# EAGLE design base (1) (EAGLE 9.3.1)
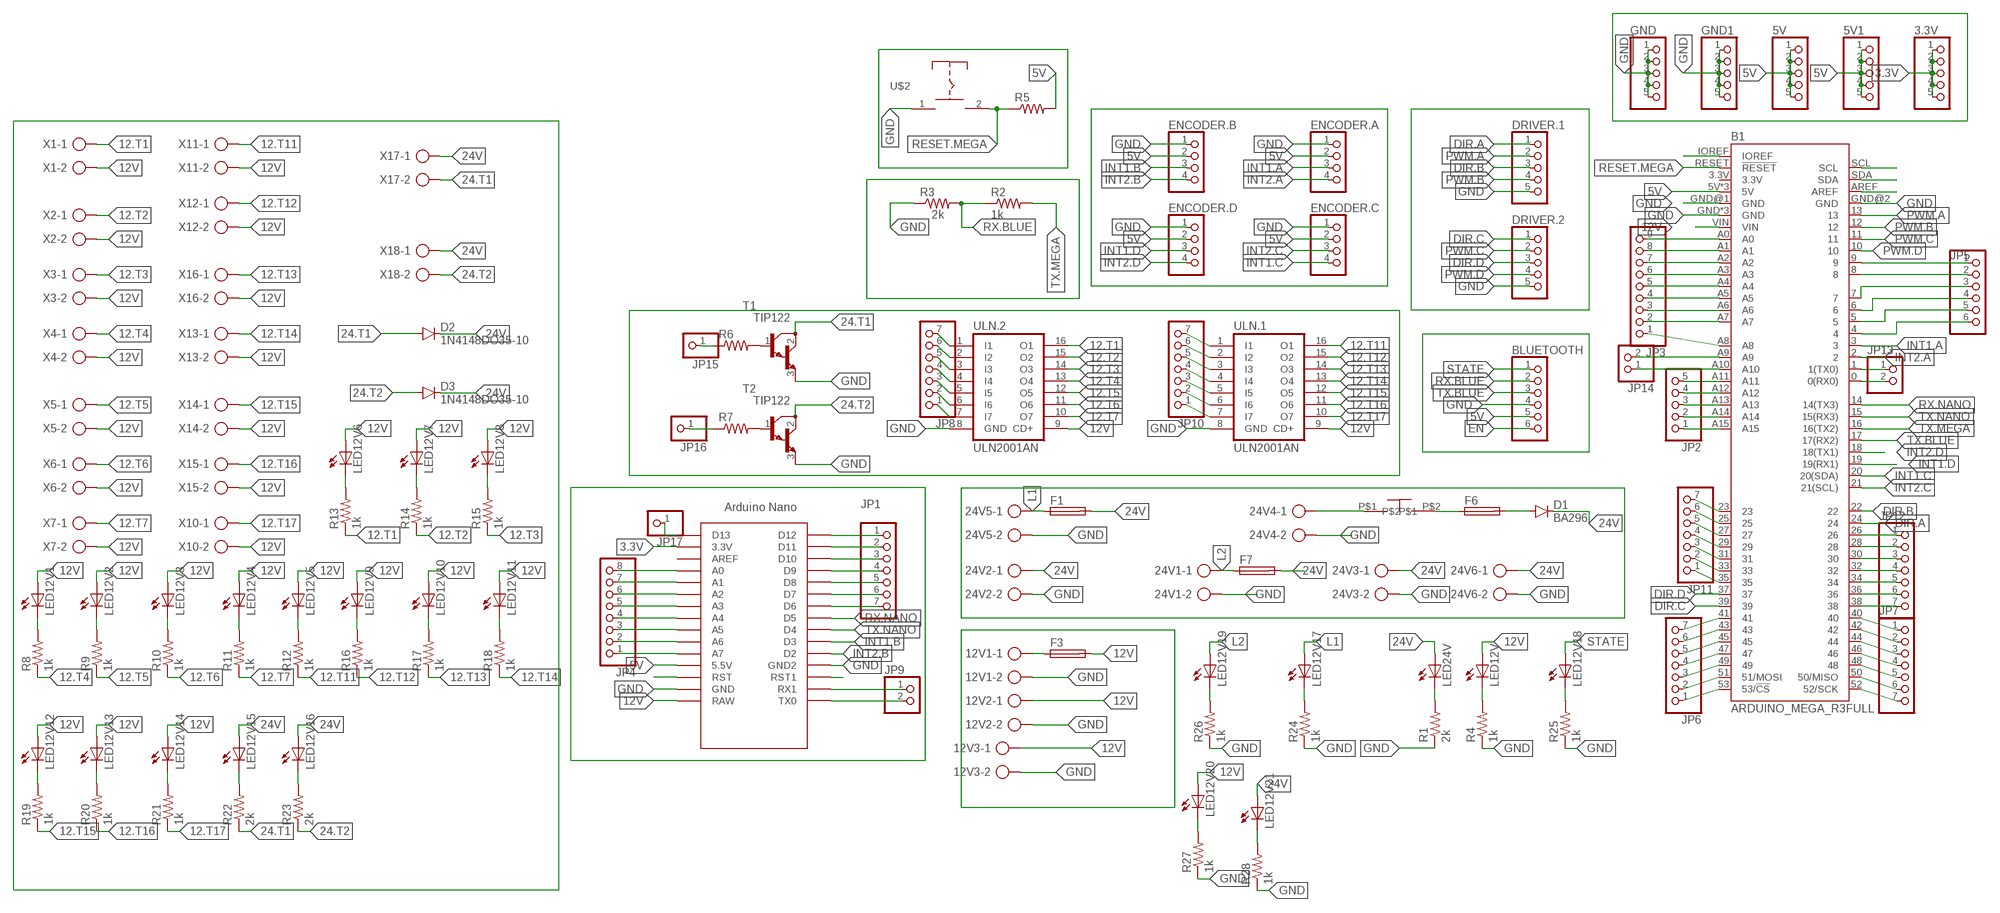
[diagram p0: schematic, sheet 1]

## Parts
3.3V  PINHD-1X5  [1X05]
5V  PINHD-1X5  [1X05]
5V1  PINHD-1X5  [1X05]
12V1  AK300/2  [AK300/2]
12V2  AK300/2  [AK300/2]
12V3  AK300/2  [AK300/2]
24V1  W237-113  [W237-113]
24V2  AK300/2  [AK300/2]
24V3  AK300/2  [AK300/2]
24V4  W237-113  [W237-113]
24V5  W237-113  [W237-113]
24V6  AK300/2  [AK300/2]
B1  ARDUINO_MEGA_R3FULL  [ARDUINO_MEGA_NO_SILK]
BLUETOOTH  PINHD-1X6  [1X06]
D1  BA296  [P2-15]
D2  1N4148DO35-10  [DO35-10]
D3  1N4148DO35-10  [DO35-10]
DRIVER.1  PINHD-1X5  [1X05]
DRIVER.2  PINHD-1X5  [1X05]
ENCODER.A  PINHD-1X4  [1X04]
ENCODER.B  PINHD-1X4  [1X04]
ENCODER.C  PINHD-1X4  [1X04]
ENCODER.D  PINHD-1X4  [1X04]
F1  SH22,5A  [SH22,5A]
F3  SH22,5A  [SH22,5A]
F6  SH22,5A  [SH22,5A]
F7  SH22,5A  [SH22,5A]
GND  PINHD-1X5  [1X05]
GND1  PINHD-1X5  [1X05]
JP1  PINHD-1X7  [1X07]
JP2  PINHD-1X5  [1X05]
JP3  PINHD-1X9  [1X09]
JP4  PINHD-1X8  [1X08]
JP5  PINHD-1X6  [1X06]
JP6  PINHD-1X7  [1X07]
JP7  PINHD-1X7  [1X07]
JP8  PINHD-1X7  [1X07]
JP9  PINHD-1X2  [1X02]
JP10  PINHD-1X7  [1X07]
JP11  PINHD-1X7  [1X07]
JP12  PINHD-1X7  [1X07]
JP13  PINHD-1X2  [1X02]
JP14  PINHD-1X2  [1X02]
JP15  PINHD-1X1  [1X01]
JP16  PINHD-1X1  [1X01]
JP17  PINHD-1X1  [1X01]
LED12V  LED5MM  [LED5MM]
LED12V1  LED3MM  [LED3MM]
LED12V2  LED3MM  [LED3MM]
LED12V3  LED3MM  [LED3MM]
LED12V4  LED3MM  [LED3MM]
LED12V5  LED3MM  [LED3MM]
LED12V6  LED3MM  [LED3MM]
LED12V7  LED3MM  [LED3MM]
LED12V8  LED3MM  [LED3MM]
LED12V9  LED3MM  [LED3MM]
LED12V10  LED3MM  [LED3MM]
LED12V11  LED3MM  [LED3MM]
LED12V12  LED3MM  [LED3MM]
LED12V13  LED3MM  [LED3MM]
LED12V14  LED3MM  [LED3MM]
LED12V15  LED3MM  [LED3MM]
LED12V16  LED3MM  [LED3MM]
LED12V17  LED3MM  [LED3MM]
LED12V18  LED3MM  [LED3MM]
LED12V19  LED3MM  [LED3MM]
LED12V20  LED3MM  [LED3MM]
LED12V21  LED3MM  [LED3MM]
LED24V  LED5MM  [LED5MM]
R1  2k  R-US_0207/10  [0207/10]
R2  1k  R-US_0204/7  [0204/7]
R3  2k  R-US_0207/10  [0207/10]
R4  1k  R-US_0207/10  [0207/10]
R5  R-US_0204/7  [0204/7]
R6  R-US_0207/10  [0207/10]
R7  R-US_0207/10  [0207/10]
R8  1k  R-US_0207/10  [0207/10]
R9  1k  R-US_0207/10  [0207/10]
R10  1k  R-US_0207/10  [0207/10]
R11  1k  R-US_0207/10  [0207/10]
R12  1k  R-US_0207/10  [0207/10]
R13  1k  R-US_0207/10  [0207/10]
R14  1k  R-US_0207/10  [0207/10]
R15  1k  R-US_0207/10  [0207/10]
R16  1k  R-US_0207/10  [0207/10]
R17  1k  R-US_0207/10  [0207/10]
R18  1k  R-US_0207/10  [0207/10]
R19  1k  R-US_0207/10  [0207/10]
R20  1k  R-US_0207/10  [0207/10]
R21  1k  R-US_0207/10  [0207/10]
R22  2k  R-US_0207/10  [0207/10]
R23  2k  R-US_0207/10  [0207/10]
R24  1k  R-US_0207/12  [0207/12]
R25  1k  R-US_0204/5  [0204/5]
R26  1k  R-US_0204/5  [0204/5]
R27  1k  R-US_0204/5  [0204/5]
R28  1k  R-US_0204/5  [0204/5]
T1  TIP122  [TO220]
T2  TIP122  [TO220]
U$1  NANO  [NANO]
U$2  PUSHBOTTON  [PUSHBOTTON]
U$3  ON_OFF  [ON_OFF]
ULN.1  ULN2001AN  [DIL16]
ULN.2  ULN2001AN  [DIL16]
X1  AK300/2  [AK300/2]
X2  AK300/2  [AK300/2]
X3  AK300/2  [AK300/2]
X4  AK300/2  [AK300/2]
X5  AK300/2  [AK300/2]
X6  AK300/2  [AK300/2]
X7  AK300/2  [AK300/2]
X10  AK300/2  [AK300/2]
X11  AK300/2  [AK300/2]
X12  AK300/2  [AK300/2]
X13  AK300/2  [AK300/2]
X14  AK300/2  [AK300/2]
X15  AK300/2  [AK300/2]
X16  AK300/2  [AK300/2]
X17  AK300/2  [AK300/2]
X18  AK300/2  [AK300/2]

## Nets
3.3V: 3.3V.1 3.3V.2 3.3V.3 3.3V.4 3.3V.5 U$1.3.3V
5V: 5V1.1 5V1.2 5V1.3 5V1.4 5V1.5 5V.1 5V.2 5V.3 5V.4 5V.5 B1.5V B1.5V@1(5V) B1.5V@2(5V) BLUETOOTH.5 ENCODER.A.2 ENCODER.B.2 ENCODER.C.2 ENCODER.D.2 R5.2 U$1.5V(5.5V)
12.T1: R13.1 ULN.2.16(O1) X1.1
12.T2: R14.1 ULN.2.15(O2) X2.1
12.T3: R15.1 ULN.2.14(O3) X3.1
12.T4: R8.1 ULN.2.13(O4) X4.1
12.T5: R9.1 ULN.2.12(O5) X5.1
12.T6: R10.1 ULN.2.11(O6) X6.1
12.T7: R11.1 ULN.2.10(O7) X7.1
12.T11: R12.1 ULN.1.16(O1) X11.1
12.T12: R16.1 ULN.1.15(O2) X12.1
12.T13: R17.1 ULN.1.14(O3) X16.1
12.T14: R18.1 ULN.1.13(O4) X13.1
12.T15: R19.1 ULN.1.12(O5) X14.1
12.T16: R20.1 ULN.1.11(O6) X15.1
12.T17: R21.1 ULN.1.10(O7) X10.1
12V: 12V2.1 12V3.1 B1.VIN F3.2 LED12V1.A LED12V2.A LED12V3.A LED12V4.A LED12V5.A LED12V6.A LED12V7.A LED12V8.A LED12V9.A LED12V10.A LED12V11.A LED12V12.A LED12V13.A LED12V14.A LED12V20.A LED12V.A U$1.RAW ULN.1.9(CD+) ULN.2.9(CD+) X1.2 X2.2 X3.2 X4.2 X5.2 X6.2 X7.2 X10.2 X11.2 X12.2 X13.2 X14.2 X15.2 X16.2
24.T1: D2.A R22.1 T1.2(C) X17.2
24.T2: D3.A R23.1 T2.2(C) X18.2
24V: 24V2.1 24V3.1 24V6.1 D1.C D2.C D3.C F1.2 F7.2 LED12V15.A LED12V16.A LED12V21.A LED24V.A X17.1 X18.1
40: B1.40 JP7.1
DIR.A: B1.24 DRIVER.1.1
DIR.B: B1.22 DRIVER.1.3
DIR.C: B1.39 DRIVER.2.1
DIR.D: B1.37 DRIVER.2.3
EN: BLUETOOTH.6
GND: 12V1.2 12V2.2 12V3.2 24V1.2 24V2.2 24V3.2 24V4.2 24V5.2 24V6.2 B1.GND B1.GND@1(GND) B1.GND@2(GND) B1.GND@3(GND) B1.GND@4(GND) BLUETOOTH.4 DRIVER.1.5 DRIVER.2.5 ENCODER.A.1 ENCODER.B.1 ENCODER.C.1 ENCODER.D.1 GND1.1 GND1.2 GND1.3 GND1.4 GND1.5 GND.1 GND.2 GND.3 GND.4 GND.5 R1.1 R3.1 R4.1 R24.1 R25.1 R26.1 R27.1 R28.1 T1.3(E) T2.3(E) U$1.GND U$1.GND1(GND2) U$2.1 ULN.1.8(GND) ULN.2.8(GND)
INT1.A: B1.3 ENCODER.A.3
INT1.B: ENCODER.B.3 U$1.D3
INT1.C: B1.20(20(SDA)) ENCODER.C.4
INT1.D: B1.19(19(RX1)) ENCODER.D.3
INT2.A: B1.2 ENCODER.A.4
INT2.B: ENCODER.B.4 U$1.D2
INT2.C: B1.21(21(SCL)) ENCODER.C.3
INT2.D: B1.18(18(TX1)) ENCODER.D.4
L1: 24V5.1 F1.1 LED12V17.A
L2: 24V1.1 F7.1 LED12V19.A
N$1: B1.SCL
N$2: B1.SDA
N$3: B1.AREF
N$7: 24V4.1 U$3.P$1
N$8: F6.1 U$3.P$2
N$9: B1.9 JP5.1
N$10: B1.8 JP5.2
N$11: B1.7 JP5.3
N$12: B1.6 JP5.4
N$13: B1.5 JP5.5
N$14: B1.4 JP5.6
N$15: JP8.1 ULN.2.7(I7)
N$16: LED12V1.K(C) R8.2
N$17: B1.1(1(TX0)) JP13.1
N$18: B1.0(0(RX0)) JP13.2
N$21: LED12V18.K(C) R25.2
N$22: LED12V19.K(C) R26.2
N$23: LED24V.K(C) R1.2
N$24: LED12V.K(C) R4.2
N$25: D1.A F6.2
N$27: LED12V2.K(C) R9.2
N$29: LED12V3.K(C) R10.2
N$30: LED12V4.K(C) R11.2
N$31: LED12V5.K(C) R12.2
N$32: LED12V6.K(C) R13.2
N$33: LED12V7.K(C) R14.2
N$34: LED12V8.K(C) R15.2
N$35: LED12V9.K(C) R16.2
N$36: LED12V10.K(C) R17.2
N$37: B1.42 JP7.2
N$38: B1.44 JP7.3
N$39: B1.46 JP7.4
N$40: B1.48 JP7.5
N$41: B1.50(50/MISO) JP7.6
N$42: B1.52(52/SCK) JP7.7
N$43: B1.IOREF
N$44: LED12V11.K(C) R18.2
N$46: LED12V12.K(C) R19.2
N$47: B1.A15 JP2.1
N$48: B1.A14 JP2.2
N$49: B1.A13 JP2.3
N$50: B1.A0 JP3.9
N$51: B1.A1 JP3.8
N$52: B1.A2 JP3.7
N$53: B1.A3 JP3.6
N$54: B1.A4 JP3.5
N$55: B1.A5 JP3.4
N$56: B1.A6 JP3.3
N$57: B1.A7 JP3.2
N$58: B1.A8 JP3.1
N$59: B1.A12 JP2.4
N$60: B1.A11 JP2.5
N$61: LED12V13.K(C) R20.2
N$62: LED12V14.K(C) R21.2
N$63: LED12V15.K(C) R22.2
N$64: LED12V16.K(C) R23.2
N$65: LED12V17.K(C) R24.2
N$66: JP8.2 ULN.2.6(I6)
N$67: JP8.3 ULN.2.5(I5)
N$68: JP8.4 ULN.2.4(I4)
N$69: JP8.5 ULN.2.3(I3)
N$70: JP8.6 ULN.2.2(I2)
N$71: JP8.7 ULN.2.1(I1)
N$72: JP10.1 ULN.1.7(I7)
N$73: JP10.2 ULN.1.6(I6)
N$74: JP10.3 ULN.1.5(I5)
N$75: B1.41 JP6.7
N$76: B1.45 JP6.5
N$77: B1.43 JP6.6
N$78: B1.47 JP6.4
N$79: B1.49 JP6.3
N$80: B1.51(51/MOSI) JP6.2
N$81: B1.53(53/!CS) JP6.1
N$82: JP10.4 ULN.1.4(I4)
N$88: JP10.5 ULN.1.3(I3)
N$89: JP10.6 ULN.1.2(I2)
N$90: JP10.7 ULN.1.1(I1)
N$91: B1.35 JP11.1
N$92: B1.33 JP11.2
N$93: B1.31 JP11.3
N$94: B1.29 JP11.4
N$95: B1.27 JP11.5
N$96: B1.25 JP11.6
N$97: B1.23 JP11.7
N$98: B1.26 JP12.1
N$99: B1.28 JP12.2
N$100: B1.30 JP12.3
N$101: B1.32 JP12.4
N$102: R6.2 T1.1(B)
N$103: R7.2 T2.1(B)
N$104: B1.34 JP12.5
N$106: B1.36 JP12.6
N$107: JP17.1 U$1.D13
N$108: B1.38 JP12.7
N$109: B1.A9 JP14.2
N$110: JP4.8 U$1.A0
N$111: JP4.7 U$1.A1
N$112: JP4.6 U$1.A2
N$113: JP4.5 U$1.A3
N$114: JP4.4 U$1.A4
N$115: JP4.3 U$1.A5
N$116: JP4.2 U$1.A6
N$117: JP4.1 U$1.A7
N$118: B1.A10 JP14.1
N$119: U$1.RST
N$120: JP15.1 R6.1
N$121: JP16.1 R7.1
N$122: JP1.1 U$1.D12
N$123: JP1.2 U$1.D11
N$124: JP1.3 U$1.D10
N$125: JP1.4 U$1.D9
N$126: JP1.5 U$1.D8
N$127: JP1.6 U$1.D7
N$128: JP1.7 U$1.D6
N$131: LED12V20.K(C) R27.2
N$132: LED12V21.K(C) R28.2
N$134: U$1.RST1
N$135: JP9.1 U$1.RX1
N$136: JP9.2 U$1.TX0
N$152: 12V1.1 F3.1
PWM.A: B1.13 DRIVER.1.2
PWM.B: B1.12 DRIVER.1.4
PWM.C: B1.11 DRIVER.2.2
PWM.D: B1.10 DRIVER.2.4
RESET.MEGA: B1.RESET(!RESET) R5.1 U$2.2
RX.BLUE: BLUETOOTH.2 R2.1 R3.2
RX.NANO: B1.14(14(TX3)) U$1.D5
STATE: BLUETOOTH.1 LED12V18.A
TX.BLUE: B1.17(17(RX2)) BLUETOOTH.3
TX.MEGA: B1.16(16(TX2)) R2.2
TX.NANO: B1.15(15(RX3)) U$1.D4
Unconnected: B1.3.3V U$1.AREF

## Library data of the parts
3.3V 5V 5V1 DRIVER.1 DRIVER.2 GND GND1 JP2 = pinhead:PINHD-1X5: PIN HEADER
12V1-12V3 24V2 24V3 24V6 X1-X7 X10-X18 = con-ptr500:AK300/2: CONNECTOR; OC_FARNELL: unknown; OC_NEWARK: unknown
24V1 24V4 24V5 = con-wago-500:W237-113: WAGO SCREW CLAMP; OC_FARNELL: unknown; OC_NEWARK: unknown
B1 = SparkFun-Boards:ARDUINO_MEGA_R3: Arduino Mega R3 ATmega2560 R3 compatible footprint. SparkFun Products: Arduino Mega 2560 R3 <https://www.sparkfun.com/products/11061>
BLUETOOTH JP5 = pinhead:PINHD-1X6: PIN HEADER
D1 = diode:BA296: DIODE
D2 D3 = diode:1N4148: DIODE high speed (Philips)
ENCODER.A ENCODER.B ENCODER.C ENCODER.D = pinhead:PINHD-1X4: PIN HEADER
F1 F3 F6 F7 = fuse:SH22,5A: FUSE HOLDER grid 22,5mm, isolated cap OGN0031 8201, Schurter (Buerklin); MPN: 0031.7701.11; OC_FARNELL: unknown; OC_NEWARK: 04F1224
JP1 JP6-JP8 JP10-JP12 = pinhead:PINHD-1X7: PIN HEADER
JP3 = pinhead:PINHD-1X9: PIN HEADER
JP4 = pinhead:PINHD-1X8: PIN HEADER
JP9 JP13 JP14 = pinhead:PINHD-1X2: PIN HEADER
JP15-JP17 = pinhead:PINHD-1X1: PIN HEADER
LED12V LED12V1-LED12V21 LED24V = led:LED: LED OSRAM: - CHIPLED LG R971, LG N971, LY N971, LG Q971, LY Q971, LO R971, LY R971 LH N974, LH R974 LS Q976, LO Q976, LY Q976 LO Q996 - Hyper CHIPLED LW Q18S LB Q993, LB Q99A, LB R99A - SideLED LS A670, LO A670, LY A670, LG A670, LP A670 LB A673, LV A673, LT A673, LW A673 LH A674 LY A675 LS A676, LA A676, LO A676, LY A676, LW A676 LS A679, LY A679, LG A679 - Hyper Micro SIDELED® LS Y876, LA Y876, LO Y876, LY Y876 LT Y87S - SmartLED LW L88C, LW L88S LB L89C, LB L89S, LG L890 LS L89K, LO L89K, LY L89K LS L896, LA L896, LO L896, LY L896 - TOPLED LS T670, LO T670, LY T670, LG T670, LP T670 LSG T670, LSP T670, LSY T670, LOP T670, LYG T670 LG T671, LOG T671, LSG T671 LB T673, LV T673, LT T673, LW T673 LH T674 LS T676, LA T676, LO T676, LY T676, LB T676, LH T676, LSB T676, LW T676 LB T67C, LV T67C, LT T67C, LS T67K, LO T67K, LY T67K, LW E67C LS E67B, LA E67B, LO E67B, LY E67B, LB E67C, LV E67C, LT E67C LW T67C LS T679, LY T679, LG T679 LS T770, LO T770, LY T770, LG T770, LP T770 LB T773, LV T773, LT T773, LW T773 LH T774 LS E675, LA E675, LY E675, LS T675 LS T776, LA T776, LO T776, LY T776, LB T776 LHGB T686 LT T68C, LB T68C - Hyper Mini TOPLED® LB M676 - Mini TOPLED Santana® LG M470 LS M47K, LO M47K, LY M47K Source: http://www.osram.convergy.de LUXEON: - LUMILED® LXK2-PW12-R00, LXK2-PW12-S00, LXK2-PW14-U00, LXK2-PW14-V00 LXK2-PM12-R00, LXK2-PM12-S00, LXK2-PM14-U00 LXK2-PE12-Q00, LXK2-PE12-R00, LXK2-PE12-S00, LXK2-PE14-T00, LXK2-PE14-U00 LXK2-PB12-K00, LXK2-PB12-L00, LXK2-PB12-M00, LXK2-PB14-N00, LXK2-PB14-P00, LXK2-PB14-Q00 LXK2-PR12-L00, LXK2-PR12-M00, LXK2-PR14-Q00, LXK2-PR14-R00 LXK2-PD12-Q00, LXK2-PD12-R00, LXK2-PD12-S00 LXK2-PH12-R00, LXK2-PH12-S00 LXK2-PL12-P00, LXK2-PL12-Q00, LXK2-PL12-R00 Source: www.luxeon.com KINGBRIGHT: KA-3528ASYC Source: www.kingbright.com
R1-R28 = rcl:R-US_: RESISTOR, American symbol; SPICEPREFIX: R
T1 T2 = transistor:TIP122: NPN BIPOLAR DARLINGTON TRANSISTOR
U$1 = Arduino-clone:NANO: Arduino Nano
U$2 = push botton:PUSHBOTTON
U$3 = ON_OFF:ON_OFF
ULN.1 ULN.2 = uln-udn:ULN2001A: DRIVER ARRAY

## Board
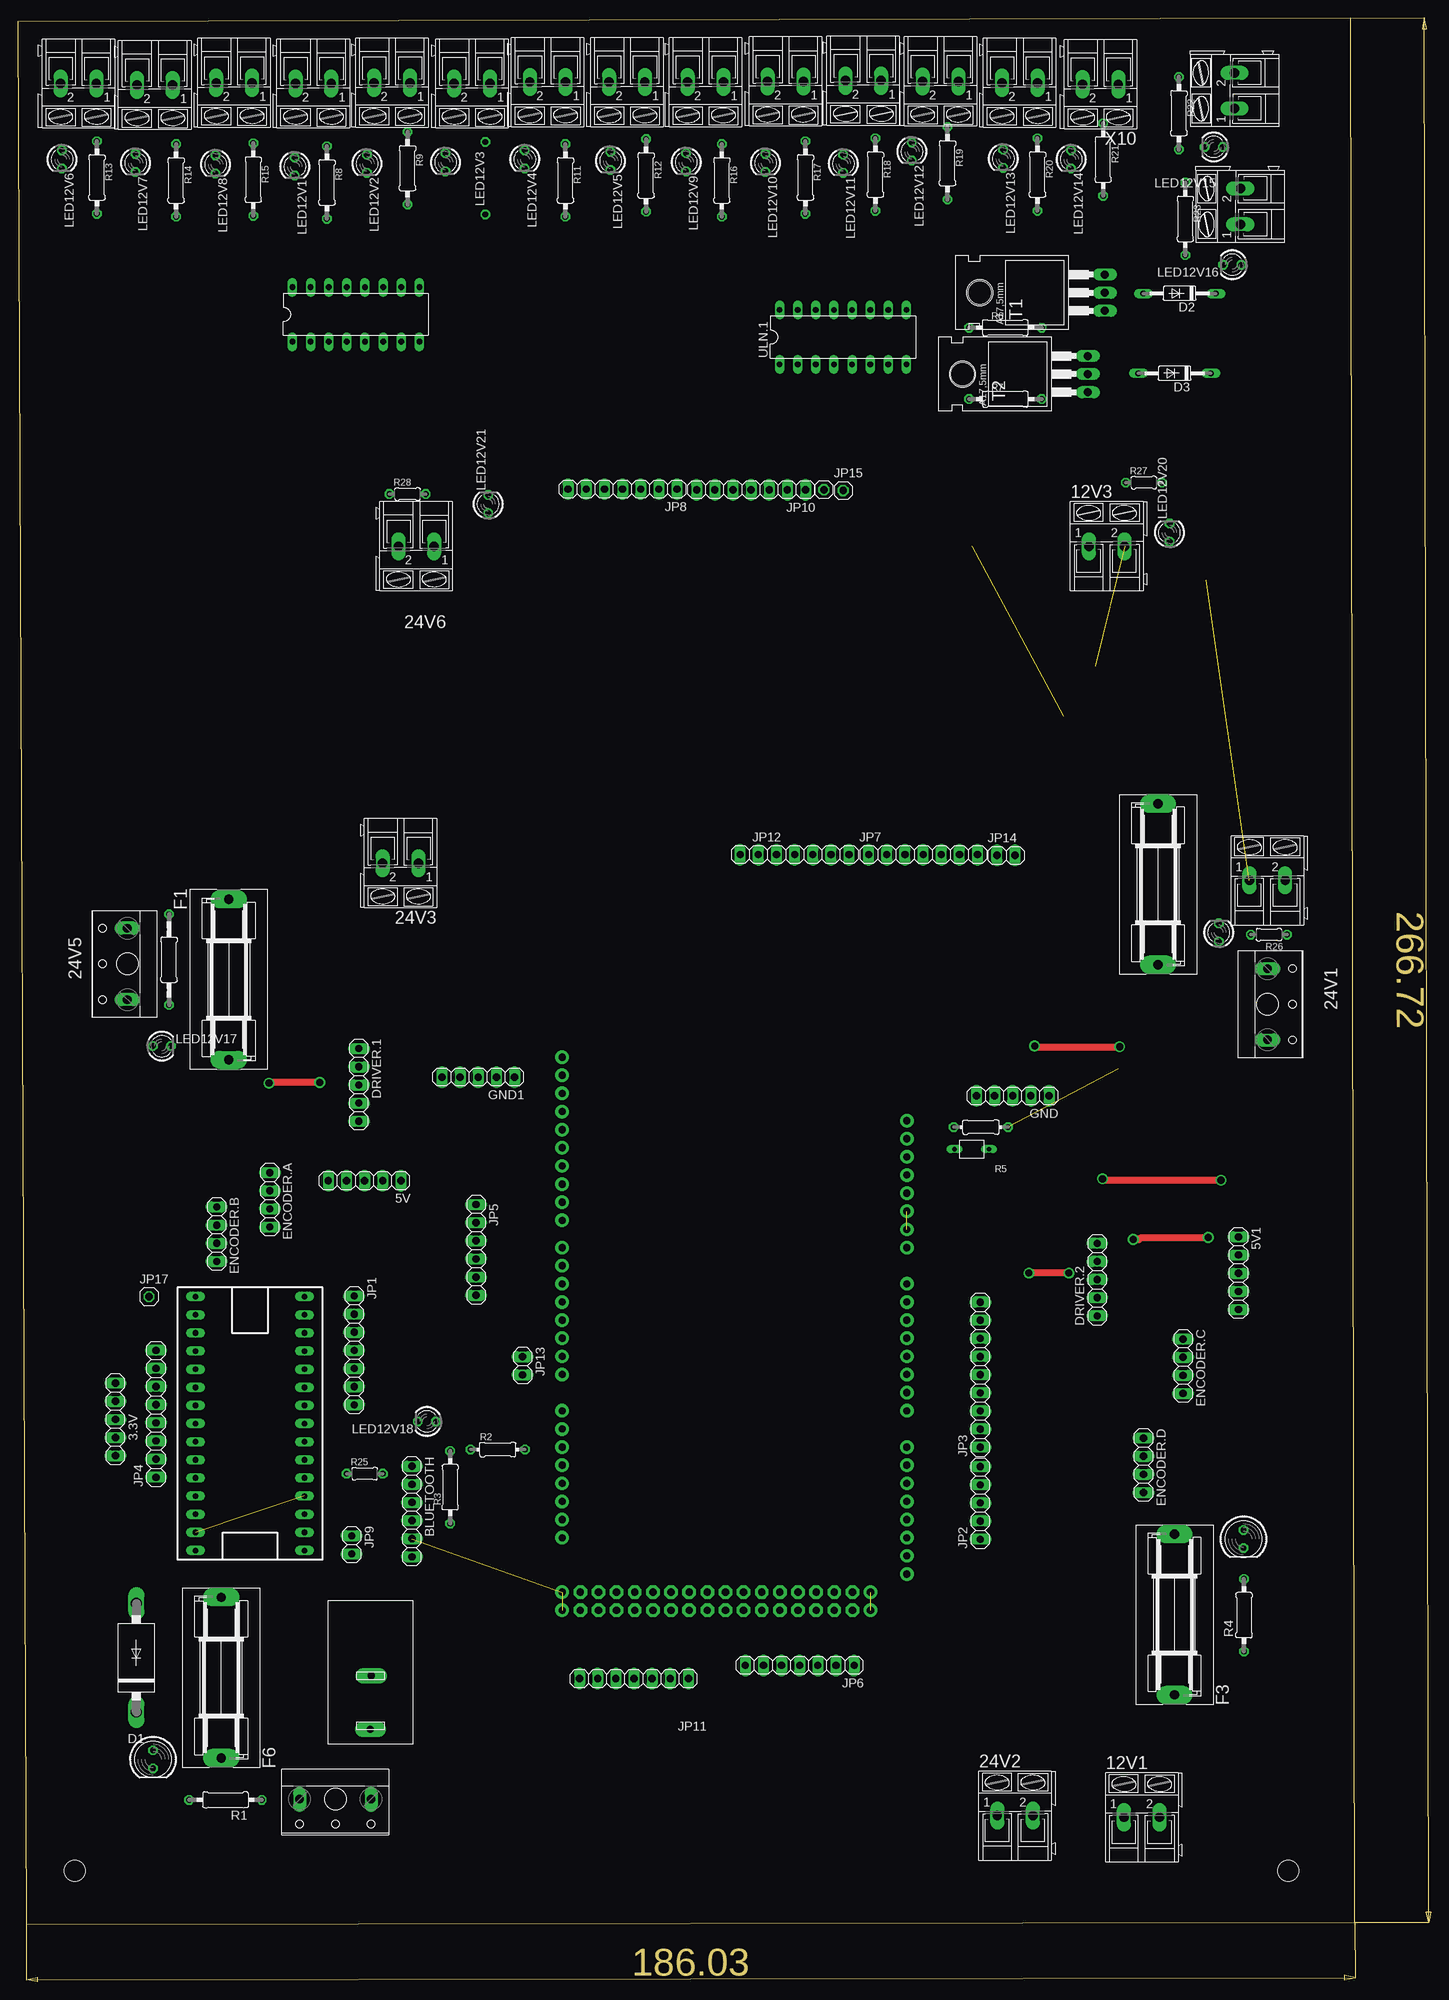
[diagram p1: board, top side]
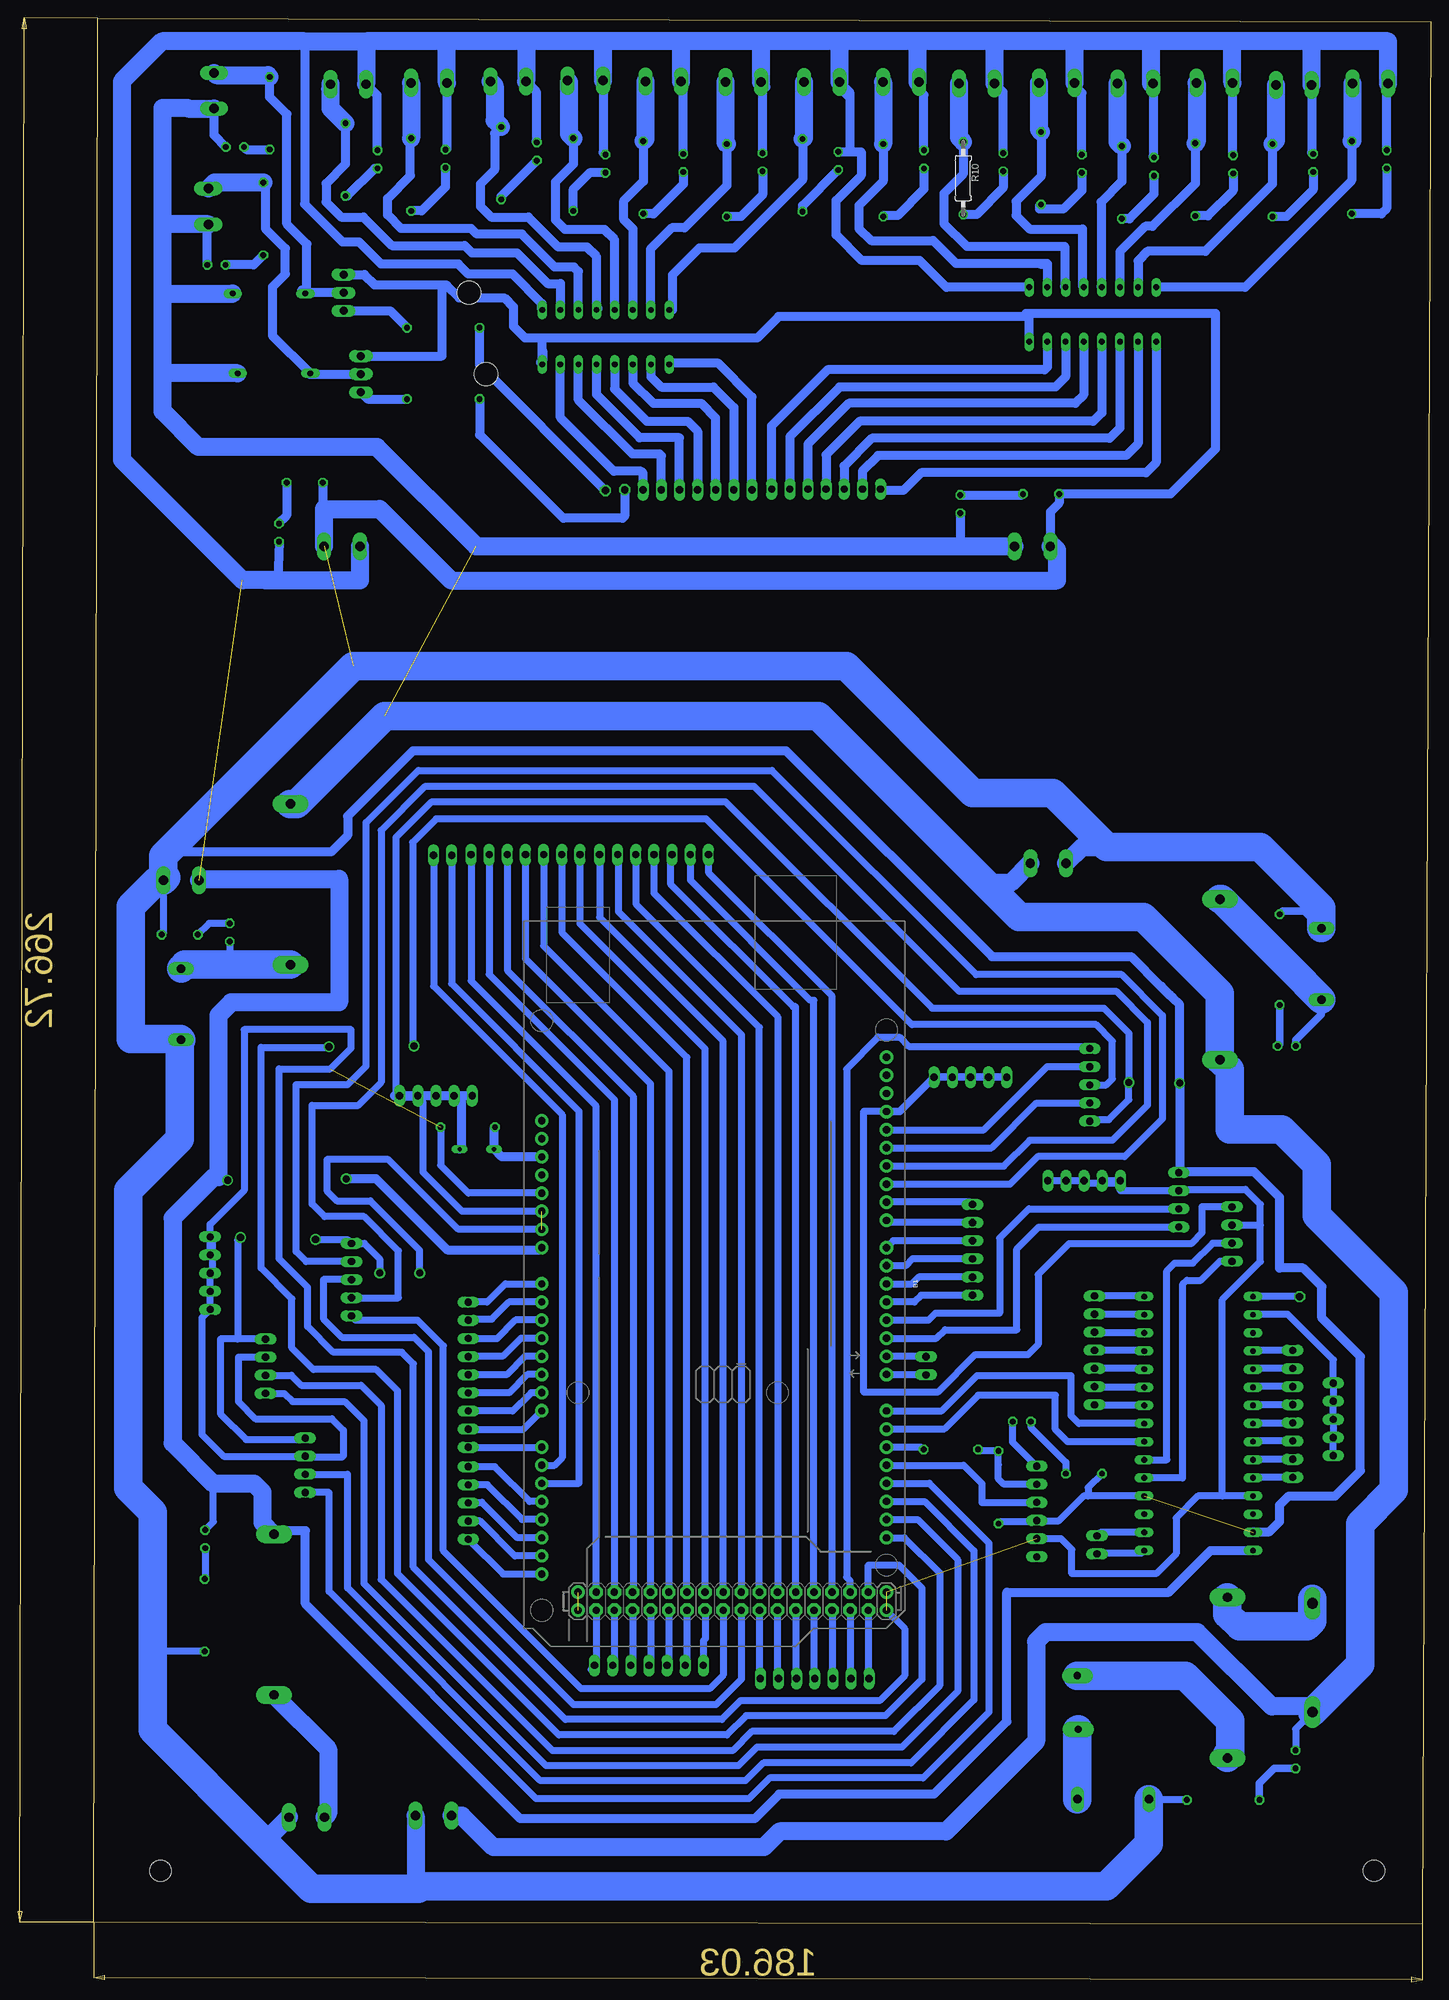
[diagram p2: board, bottom side, seen from below]

Size 187.22 x 267 mm. Coordinates in mm from the lower left corner, seen from the top.
Outline: 1.19,0 187.22,0.28 186.63,267 0,266.49 1.19,0
Copper layers (1*16): Top 0.035mm / dielectric 1.5mm / Bottom 0.035mm
Design rules "default *": minimum track width 6mil, minimum drill 0.35mm, track to track 40mil, track to pad 40mil, pad to pad 6mil, via to via 6mil, smd to smd 6mil, copper to edge 40mil, drill to drill 6mil, minimum pad ring 10mil, minimum via ring 8mil, stop-mask expansion 4mil, vias tented up to drill 0mil, thermal gap 10mil
Holes 3 mm at 7.96,7.52 177.87,7.52

### Footprints (pad centres in the part's own frame; a part is rotated, then mirrored left to right if it is on the bottom)
1X05 = drill 1.016 long: 1 -5.08,0; 2 -2.54,0; 3 0,0; 4 2.54,0; 5 5.08,0
AK300/2 = drill 1.321 long: 1 -2.515,0; 2 2.489,0
W237-113 = drill 1.194 long: 1 -5,-1.27; 2 5,-1.27
ARDUINO_MEGA_NO_SILK = drill 1.016 pad 1.88: 0 13.97,24.13; 1 11.43,24.13; 2 8.89,24.13; 3 6.35,24.13; 3.3V -13.97,-24.13; 4 3.81,24.13; 5 1.27,24.13; 5V -11.43,-24.13; 5V@1 44.45,24.13; 5V@2 46.99,24.13; 6 -1.27,24.13; 7 -3.81,24.13; 8 -7.62,24.13; 9 -10.16,24.13; 10 -12.7,24.13; 11 -15.24,24.13; 12 -17.78,24.13; 13 -20.32,24.13; 14 19.05,24.13; 15 21.59,24.13; 16 24.13,24.13; 17 26.67,24.13; 18 29.21,24.13; 19 31.75,24.13; 20 34.29,24.13; 21 36.83,24.13; A0 1.27,-24.13; A1 3.81,-24.13; A2 6.35,-24.13; A3 8.89,-24.13; A4 11.43,-24.13; A5 13.97,-24.13; A6 16.51,-24.13; A7 19.05,-24.13; A8 24.13,-24.13; A9 26.67,-24.13; A10 29.21,-24.13; A11 31.75,-24.13; A12 34.29,-24.13; A13 36.83,-24.13; A14 39.37,-24.13; A15 41.91,-24.13; AREF -25.4,24.13; GND -8.89,-24.13; GND@1 -6.35,-24.13; GND@2 44.45,-19.05; GND@3 46.99,-19.05; GND@4 -22.86,24.13; IOREF -19.05,-24.13; NC -21.59,-24.13; RESET -16.51,-24.13; SCL -30.48,24.13; SDA -27.94,24.13; VIN -3.81,-24.13 | drill 1.016 pad 1.88 octagon: 22 44.45,21.59; 23 46.99,21.59; 24 44.45,19.05; 25 46.99,19.05; 26 44.45,16.51; 27 46.99,16.51; 28 44.45,13.97; 29 46.99,13.97; 30 44.45,11.43; 31 46.99,11.43; 32 44.45,8.89; 33 46.99,8.89; 34 44.45,6.35; 35 46.99,6.35; 36 44.45,3.81; 37 46.99,3.81; 38 44.45,1.27; 39 46.99,1.27; 40 44.45,-1.27; 41 46.99,-1.27; 42 44.45,-3.81; 43 46.99,-3.81; 44 44.45,-6.35; 45 46.99,-6.35; 46 44.45,-8.89; 47 46.99,-8.89; 48 44.45,-11.43; 49 46.99,-11.43; 50 44.45,-13.97; 51 46.99,-13.97; 52 44.45,-16.51; 53 46.99,-16.51
1X06 = drill 1.016 long: 1 -6.35,0; 2 -3.81,0; 3 -1.27,0; 4 1.27,0; 5 3.81,0; 6 6.35,0
P2-15 = drill 1.499 long: A 7.62,0; C -7.62,0
DO35-10 = drill 0.813 long: A 5.08,0; C -5.08,0
1X04 = drill 1.016 long: 1 -3.81,0; 2 -1.27,0; 3 1.27,0; 4 3.81,0
SH22,5A = drill 1.321 pad 2.54 long: 1 -11.252,0; 2 11.252,0
1X07 = drill 1.016 long: 1 -7.62,0; 2 -5.08,0; 3 -2.54,0; 4 0,0; 5 2.54,0; 6 5.08,0; 7 7.62,0
1X09 = drill 1.016 long: 1 -10.16,0; 2 -7.62,0; 3 -5.08,0; 4 -2.54,0; 5 0,0; 6 2.54,0; 7 5.08,0; 8 7.62,0; 9 10.16,0
1X08 = drill 1.016 long: 1 -8.89,0; 2 -6.35,0; 3 -3.81,0; 4 -1.27,0; 5 1.27,0; 6 3.81,0; 7 6.35,0; 8 8.89,0
1X02 = drill 1.016 long: 1 -1.27,0; 2 1.27,0
1X01 = drill 1.016 octagon: 1 0,0
LED5MM = drill 0.813 octagon: A -1.27,0; K 1.27,0
LED3MM = drill 0.813 octagon: A -1.27,0; K 1.27,0
0207/10 = drill 0.813 octagon: 1 -5.08,0; 2 5.08,0
0204/7 = drill 0.813 octagon: 1 -3.81,0; 2 3.81,0
0207/12 = drill 0.813 octagon: 1 -6.35,0; 2 6.35,0
0204/5 = drill 0.813 octagon: 1 -2.54,0; 2 2.54,0
TO220 = drill 1.118 long: 1 -2.54,-6.35; 2 0,-6.35; 3 2.54,-6.35 | hole 3.302: 0,11.176
NANO = drill 0.8 long: 3.3V -10.16,24.13; 5V -10.16,-1.27; A0 -10.16,19.05; A1 -10.16,16.51; A2 -10.16,13.97; A3 -10.16,11.43; A4 -10.16,8.89; A5 -10.16,6.35; A6 -10.16,3.81; A7 -10.16,1.27; AREF -10.16,21.59; D2 5.08,1.27; D3 5.08,3.81; D4 5.08,6.35; D5 5.08,8.89; D6 5.08,11.43; D7 5.08,13.97; D8 5.08,16.51; D9 5.08,19.05; D10 5.08,21.59; D11 5.08,24.13; D12 5.08,26.67; D13 -10.16,26.67; GND -10.16,-6.35; GND1 5.08,-1.27; RAW -10.16,-8.89; RST -10.16,-3.81; RST1 5.08,-3.81; RX1 5.08,-6.35; TX0 5.08,-8.89
PUSHBOTTON = drill 0.6 long: 1 -12.43,5.08; 2 -7.62,5.08
ON_OFF = drill 1 pad 2.184 long: P$1 2,9; P$2 9.525,8.89
DIL16 = drill 0.813 long: 1 -8.89,-3.81; 2 -6.35,-3.81; 3 -3.81,-3.81; 4 -1.27,-3.81; 5 1.27,-3.81; 6 3.81,-3.81; 7 6.35,-3.81; 8 8.89,-3.81; 9 8.89,3.81; 10 6.35,3.81; 11 3.81,3.81; 12 1.27,3.81; 13 -1.27,3.81; 14 -3.81,3.81; 15 -6.35,3.81; 16 -8.89,3.81

### Placement (x,y rotation side)
3.3V  13.66,70.73 270 top
5V  48.55,104.16 180 top
5V1  170.9,91.2 270 top
12V1  157.39,15 0 top
12V2  174.97,146.22 0 top
12V3  152.47,193.02 0 top
24V1  176.26,128.87 270 top
24V2  139.65,15.22 0 top
24V3  53.56,148.62 180 top
24V4  44.47,16.26 180 top
24V5  14.05,134.52 90 top
24V6  55.77,193.02 180 top
B1  100.34,90.98 270 bottom
BLUETOOTH  55.17,57.83 270 top
D1  16.58,37.34 90 top
D2  162.66,228.42 180 top
D3  161.97,217.22 180 top
DRIVER.1  47.75,117.58 270 top
DRIVER.2  151.13,90.3 90 top
ENCODER.A  35.28,101.48 270 top
ENCODER.B  27.83,96.67 270 top
ENCODER.C  163.16,78.17 270 top
ENCODER.D  157.61,64.3 270 top
F1  29.53,132.34 270 top
F3  161.97,43.4 90 top
F6  28.48,34.55 90 top
F7  159.67,145.68 90 top
GND  139.3,116.04 180 top
GND1  64.46,118.66 180 top
JP1  47.09,80.39 270 top
JP2  134.77,59.02 90 top
JP3  134.77,76.99 90 top
JP4  19.34,71.51 90 top
JP5  64.17,94.47 270 top
JP6  109.48,36.27 180 top
JP7  126.75,149.82 0 top
JP8  84.67,201.02 180 top
JP9  46.74,53.16 270 top
JP10  102.67,200.92 180 top
JP11  86.27,34.42 180 top
JP12  108.77,149.82 0 top
JP13  70.67,78.24 270 top
JP14  138.37,149.72 0 top
JP15  115.56,200.82 0 top
JP16  112.87,200.92 0 top
JP17  18.36,87.92 0 top
LED12V  171.61,53.98 270 top
LED12V1  38.77,246.19 270 top
LED12V2  48.86,246.59 270 top
LED12V3  59.87,246.79 270 top
LED12V4  70.97,247.19 270 top
LED12V5  82.97,246.99 270 top
LED12V6  6.16,247.19 270 top
LED12V7  16.46,246.69 270 top
LED12V8  27.67,246.49 270 top
LED12V9  93.56,246.79 270 top
LED12V10  104.67,246.69 270 top
LED12V11  115.56,246.59 270 top
LED12V12  125.16,248.29 270 top
LED12V13  137.97,247.29 270 top
LED12V14  147.47,247.19 270 top
LED12V15  167.44,248.92 180 top
LED12V16  170.03,232.42 180 top
LED12V17  20.16,123.02 0 top
LED12V18  57.27,70.42 180 top
LED12V19  168.16,138.92 90 top
LED12V20  161.27,194.92 90 top
LED12V21  65.87,198.92 90 top
LED24V  18.93,23.11 270 top
R1  29.07,17.44 180 top
R2  67.2,66.51 0 top
R3  60.53,61.22 90 top
R4  171.68,43.31 90 top
R5  134.84,111.66 0 top
R6  138.27,223.62 0 top
R7  138.27,213.62 0 top
R8  43.27,243.96 270 top
R9  54.56,245.96 270 top
R10  65.47,244.56 270 bottom
R11  76.67,244.26 270 top
R12  87.97,244.96 270 top
R13  11.07,244.66 270 top
R14  22.16,244.26 270 top
R15  32.97,244.36 270 top
R16  98.56,244.26 270 top
R17  110.27,244.66 270 top
R18  120.06,245.06 270 top
R19  130.16,246.66 270 top
R20  142.77,245.06 270 top
R21  151.97,247.16 270 top
R22  162.56,253.66 270 top
R23  163.47,238.86 270 top
R24  21.16,135.12 270 top
R25  48.56,63.12 0 top
R26  175.16,138.62 180 top
R27  157.66,201.92 0 top
R28  54.56,200.32 0 top
T1  145.87,228.52 90 top
T2  143.47,217.12 90 top
U$1  35.05,61.25 0 top
U$2  123.54,113.66 180 top
U$3  58.37,25.32 90 top
ULN.1  115.53,222.3 0 top
ULN.2  47.33,225.47 0 top
X1  8.46,257.82 180 top
X2  19.16,257.62 180 top
X3  30.26,257.92 180 top
X4  41.36,257.82 180 top
X5  52.36,257.92 180 top
X6  63.56,257.82 180 top
X7  74.17,258.02 180 top
X10  151.56,257.72 180 top
X11  85.27,258.02 180 top
X12  96.27,258.02 180 top
X13  118.37,258.22 180 top
X14  129.16,258.12 180 top
X15  140.27,257.92 180 top
X16  107.47,258.12 180 top
X17  170.37,256.82 90 top
X18  171.16,240.62 90 top

### Tracks (layer width: path | path; a pad name or v marks a point on that pad's centre or on a via)
3.3V
  Bottom 1: 3.3V.5 3.3V.4 3.3V.3 3.3V.2 3.3V.1 13.66,79.07 20.07,85.48 24.79,85.48 U$1.3.3V
5V  (3 unrouted)
  Bottom 1: 27.65,98.12 ENCODER.B.2 23.86,97.94 | 5V.1 5V.2 5V.3 48.25,103.86 44.25,103.86 44.55,104.16 5V.4 5V.5 43.47,102.75 ENCODER.A.2 35.08,102.95 25.96,102.95 23.86,100.85 23.86,97.94 | U$1.5V 29.17,59.98 | 29.17,59.98 32.61,59.98 35.67,56.92 35.67,51.92 38.47,49.12 50.27,49.12 50.27,52.52 51.77,54.02 BLUETOOTH.5 | 170.6,94.41 170.91,94.1 5V1.2 5V1.1 170.91,98.04 166.16,102.78 166.16,125.32 151.16,125.32 151.16,122.72 154.06,119.82 161.27,119.82 161.27,93.22 157.27,89.22 157.27,83.72 153.66,80.12 144.06,80.12 142.47,78.52 142.47,50.02 121.16,28.72 99.27,28.72 96.67,31.32 77.17,31.32 73.67,34.82 73.67,41.44 B1.5V@2 | 170.6,96.34 170.6,91.5 5V1.3 5V1.4 5V1.5 172.06,84.96 172.06,68.62 169.01,65.57 ENCODER.D.2 157.47,65.42 152.47,65.42 152.27,65.62 152.27,69.22 153.87,70.82 164.56,70.82 166.97,73.22 166.97,79.44 ENCODER.C.2 | B1.5V 134.75,102.41 138.65,106.31 R5.2 | 29.17,59.98 29.17,87.52 23.86,92.82 23.86,97.94
12.T1
  Bottom 1.27: R13.1 11.07,244.22 26,229.28 ULN.2.16
  Bottom 2.54: X1.1 10.98,249.83 R13.1
12.T2
  Bottom 1.27: 22.36,249.14 R14.1 22.16,243.72 31.57,234.32 39.67,234.32 40.98,233 ULN.2.15
  Bottom 2.54: X2.1 21.68,249.83 R14.1
12.T3
  Bottom 1.27: R15.1 32.97,243.82 38.97,237.82 39.97,237.82 43.53,234.26 ULN.2.14
  Bottom 2.54: X3.1 32.78,249.63 R15.1
12.T4
  Bottom 1.27: R8.1 43.27,244.12 46.17,241.22 46.17,229.38 ULN.2.13
  Bottom 2.54: X4.1 43.88,249.66 R8.1
12.T5
  Bottom 1.27: 55.06,257.62 55.36,257.92 | 55.47,258.02 55.36,257.92 | 55.36,257.92 X5.1 | R9.1 54.56,244.82 58.06,241.32 58.06,239.32 56.17,237.42 48.77,237.42 48.77,229.44 ULN.2.12
  Bottom 2.54: X5.1 54.88,251.36 R9.1
12.T6
  Bottom 1.27: 65.56,257.31 X6.1 | R10.1 65.47,245.12 68.17,242.42 68.17,238.22 64.97,235.02 51.27,235.02 51.27,229.4 ULN.2.11
  Bottom 2.54: X6.1 66.08,250.26 R10.1
12.T7
  Bottom 1.27: 53.77,232.62 54.77,232.62 | 54.77,232.62 66.47,232.62 69.67,235.82 78.37,235.82 80.06,237.52 80.06,240.72 76.67,244.12 R11.1 | ULN.2.10 53.69,232.54 54.69,232.54 54.77,232.62
  Bottom 2.54: X7.1 76.68,249.36 R11.1
12.T11
  Bottom 1.27: R12.1 87.97,244.32 97.52,234.77 102.42,234.77 106.17,231.01 106.17,226.11 ULN.1.16
  Bottom 2.54: X11.1 87.78,250.23 R12.1
12.T12
  Bottom 1.27: R16.1 98.56,243.52 104.47,237.62 106.27,237.62 109.28,234.6 109.28,226.21 ULN.1.15
  Bottom 2.54: X12.1 98.78,249.56 R16.1
12.T13
  Bottom 1.27: R17.1 110.27,244.12 112.97,241.42 112.97,238.72 111.73,237.48 ULN.1.14
  Bottom 2.54: X16.1 109.98,250.03 R17.1
12.T14
  Bottom 1.27: R18.1 120.06,246.52 122.56,244.02 122.56,238.72 121.22,237.37 115.72,237.37 114.27,235.92 ULN.1.13 | X13.1 120.68,258.02
  Bottom 2.54: 120.68,258.02 120.68,250.76 R18.1
12.T15
  Bottom 1.27: R19.1 131.06,250.84 131.06,245.72 133.06,243.72 133.06,240.62 131.56,239.12 126.37,239.12 122.16,234.92 118.17,234.92 116.81,233.56 ULN.1.12 116.61,226.31
  Bottom 2.54: X14.1 131.08,257.52 131.08,252.66 R19.1
12.T16
  Bottom 1.27: 142.78,250.16 142.87,250.07 142.87,244.92 146.06,241.72 146.06,239.42 144.16,237.52 134.37,237.52 133.56,236.72 127.27,236.72 122.66,232.12 119.97,232.12 119.34,231.5 ULN.1.11
  Bottom 2.54: X15.1 142.78,250.16 R20.1
12.T17
  Bottom 1.27: 154.75,257.06 X10.1 | R21.1 151.97,246.52 154.66,243.82 154.66,241.22 152.56,239.12 149.47,239.12 145.47,235.12 135.27,235.12 134.27,234.12 127.97,234.12 123.66,229.82 121.87,229.82 121.87,226.13 ULN.1.10
  Bottom 2.54: X10.1 154.08,254.36 R21.1
12V  (via drill 1 pad 0.95)  (1 unrouted)
  Top 1: v168.47,104.22 152.06,104.22 v151.87,104.42
  Bottom 1: LED12V.A 170.47,56.4 170.47,61.72 | X4.2 39.77,258.71 39.77,259.62 39.86,259.72 39.86,260.22 39.77,260.32 39.17,260.32
  Bottom 1.27: B1.VIN 124.78,94.49 137.74,94.49 147.66,104.42 v151.87,104.42 | U$1.RAW 30.82,52.36 36.67,46.52 59.37,46.52 59.37,28.43 69.56,18.23 91.26,18.23 94.66,14.82 127.47,14.82 157.56,44.92 157.56,55.12 162.06,55.12 162.53,54.66 | 162.66,54.52 162.53,54.66 | 162.53,54.66 F3.2 | 16.62,257.57 X2.2 16.68,248.17 LED12V7.A | 50.36,258.02 50.27,257.92 | 50.27,257.92 X5.2 | X6.2 59.87,256.61 LED12V3.A | 93.06,257.31 X12.2 93.56,257.81 LED12V9.A | 115.88,257.53 X13.2 115.88,248.17 LED12V11.A | LED12V20.A 161.42,188.22 | LED12V6.A 6.16,257.63 X1.2 | X3.2 27.78,247.87 LED12V8.A | X4.2 38.88,247.57 LED12V1.A | LED12V2.A 48.86,256.52 50.27,257.92 | LED12V4.A 70.97,256.22 72.27,257.52 72.18,257.52 X7.2 71.87,258.21 71.87,260.62 | 81.37,248.26 81.37,256.61 X11.2 82.97,257.83 82.97,257.42 81.62,256.08 | ULN.2.9 67.83,229.28 71.56,233.02 79.67,233.02 83.27,236.62 83.27,241.42 79.77,244.92 79.77,248.26 81.37,248.26 | LED12V10.A 104.67,257.81 X16.2 | X14.2 125.28,256.72 125.28,249.67 LED12V12.A | X15.2 137.78,248.75 LED12V13.A | X10.2 147.58,256.22 147.58,248.46 LED12V14.A | ULN.1.9 124.47,226.15 124.47,227.02 128.56,231.12 134.77,231.12 136.16,232.52 146.97,232.52 150.06,235.62 152.37,235.62 157.66,240.92 157.66,263.72 | LED12V5.A 81.37,248.26 | 171.27,104.72 170.37,104.72 169.77,104.72 | 169.77,104.62 168.87,104.62 v168.47,104.22
  Bottom 2.54: 12V2.1 172.25,146.42 152.87,146.42 152.87,129.12 167.97,129.12 169.77,127.32 169.77,104.72 169.77,104.62 | F3.2 163.56,56.25 163.56,60.52 164.77,61.72 170.47,61.72 176.16,67.42 176.16,98.92 170.37,104.72 | X1.2 5.98,263.72 16.68,263.72 | 16.68,263.72 27.78,263.72 | 27.78,263.72 39.17,263.72 | 39.17,263.72 49.88,263.72 | 49.88,263.72 61.08,263.72 | 61.08,263.72 71.87,263.72 | 71.87,263.72 82.78,263.72 | 82.78,263.72 93.78,263.72 | 93.78,263.72 104.98,263.72 | 104.98,263.72 115.88,263.72 | 115.88,263.72 126.66,263.72 | 126.66,263.72 137.78,263.72 | 137.78,263.72 149.08,263.72 | 149.08,263.72 X10.2 | X15.2 137.78,263.72 | 126.66,263.72 126.66,258.13 X14.2 | X2.2 16.68,263.72 | X3.2 27.78,263.72 | 39.17,257.82 39.17,260.32 39.17,263.72 | X5.2 49.88,263.72 | X6.2 61.08,263.72 | 71.87,258.02 71.87,260.62 71.87,263.72 | X11.2 82.78,263.72 | X12.2 93.78,263.72 | X16.2 104.98,263.72 | X13.2 115.88,263.72 | 12V3.1 149.95,188.22 161.42,188.22 163.13,188.22 163.16,188.25 | 149.08,263.72 157.66,263.72 177.66,263.72 183.27,258.12 183.27,205.12 166.4,188.25 163.16,188.25 | 161.19,188.25 163.16,188.25
24.T1
  Bottom 1.27: 157.37,228.64 157.37,228.52 T1.2 | 157.37,228.64 157.37,235.32 160.16,238.12 160.16,253.52 162.56,255.92 R22.1 | 157.66,228.52 158.06,228.92 158.06,228.9 D2.A 157.37,228.64
  Bottom 2.54: X17.2 170.06,259.01 162.83,259.01 R22.1
24.T2
  Bottom 1.27: T2.2 157.1,217.12 D3.A 162.19,222.52 162.19,229.3 160.37,231.12 160.37,234.72 163.16,237.52 163.16,243.64 R23.1
  Bottom 2.54: R23.1 170.33,243.94 X18.2
24V  (1 unrouted)
  Bottom 1: D1.C 18.93,27.37 LED24V.A
  Bottom 1.27: LED12V21.A 65.87,193.02 24V6.1 | LED12V15.A 170.37,250.58 X17.1 | LED12V16.A 171.31,238.68 171.27,238.72 171.16,238.62 X18.1
  Bottom 2.54: D1.C 17.38,30.52 22.27,30.52 32.67,40.92 53.97,40.92 55.27,39.62 55.27,25.62 67.87,13.02 91.17,13.02 93.37,10.82 131.27,10.82 135.67,15.22 24V2.1 | 24V6.1 133.66,193.02 147.56,206.92 172.56,206.92 177.56,211.92 177.56,217.22 | X17.1 173.98,254.31 174.09,254.42 177.56,254.42 177.56,237.72 | 177.56,217.22 177.56,228.32 | 177.56,228.32 177.56,237.72 | X18.1 177.05,238.11 177.06,238.12 177.16,238.12 177.56,237.72 | D2.C 167.84,228.32 177.56,228.32 | D3.C 177.56,217.22 | 24V3.1 58.83,145.87 62.42,145.87
  Bottom 4: F7.2 158.77,156.93 146.48,169.22 85.77,169.22 62.42,145.87 57.63,141.09 40.23,141.09 29.53,130.39 F1.2 28.17,119.72 28.17,111.32 20.87,111.32 18.57,109.02 15.96,106.42 15.96,99.32 5.16,88.52 5.16,60.82 9.86,56.12 9.86,36.44 D1.C
40
  Bottom 1: B1.40 101.62,122.62 119.14,140.14 JP7.1
DIR.A
  Bottom 1: B1.24 81.3,48.13 81.8,48.63 81.8,119.79 77.33,124.26 | 77.33,124.26 77.47,124.26 | 77.33,124.26 74.37,124.26 73.06,122.96 47.75,122.96 DRIVER.1.1
DIR.B  (via drill 1 pad 0.95)
  Top 1: v154.27,122.92 154.16,122.82 142.56,122.82 v142.37,123.02
  Bottom 1: B1.22 78.76,50.32 74.47,50.32 71.27,47.12 71.27,34.32 76.37,29.22 95.87,29.22 98.56,26.52 122.06,26.52 144.66,49.12 144.66,74.72 147.66,77.72 156.47,77.72 159.47,80.72 159.47,87.62 163.77,91.92 163.77,122.82 154.37,122.82 v154.27,122.92 | v142.37,123.02 142.56,123.22 142.56,151.52 139.27,154.82 101.47,154.82 72.67,126.02 46.86,126.02 44.56,123.72 44.56,118.42 45.41,117.58 DRIVER.1.3
DIR.C
  Bottom 1: B1.39 99.08,34.91 100.97,33.02 118.97,33.02 138.27,52.32 138.27,81.02 141.87,84.62 150.53,84.62 DRIVER.2.1
DIR.D
  Bottom 1: DRIVER.2.3 155.06,90.3 155.06,84.82 152.47,82.22 142.37,82.22 140.37,80.22 140.37,51.12 120.06,30.82 100.06,30.82 96.53,34.35 B1.37
GND  (via drill 1 pad 0.95)  (4 unrouted)
  Top 1: v147.16,91.22 v141.56,91.22 | v166.66,96.22 166.56,96.12 157.16,96.12 156.97,95.92 v156.16,95.92 | v42.27,117.92 35.27,117.92 v35.17,117.82
  Bottom 0.305: 36.86,130.52 36.17,130.52 36.17,129.82
  Bottom 1: U$1.GND1 47.97,59.98 | 47.97,59.98 48.61,59.98 52.06,56.52 55.17,56.52 BLUETOOTH.4 55.3,56.44 60.23,56.44 R3.1 | R25.1 47.97,61.18 47.97,59.98 | ENCODER.B.1 32.03,100.48 32.03,96.85 33.56,95.32 50.67,95.32 54.97,91.02 54.97,81.22 56.37,79.82 63.77,79.82 69.06,74.52 79.37,74.52 79.37,113.92 76.22,113.92 B1.GND@4 | B1.GND 135.62,99.87 141.12,105.37 141.12,115.18 141.98,116.04 GND.1 | ENCODER.D.1 157.8,67.92 165.87,67.92 169.47,71.52 169.47,81.98 167.06,81.98 | B1.GND@1 124.58,97.43 136.28,97.43 145.97,107.12 154.56,107.12 154.56,102.72 153.16,101.32 148.47,101.32 141.56,94.42 v141.56,91.22 | v147.16,91.22 147.16,93.22 149.32,95.38 DRIVER.2.5 151.68,95.92 v156.16,95.92 | ENCODER.C.1 167.06,81.98 | v166.66,96.22 167.06,95.82 167.06,81.98 | GND.5 144.87,116.04 144.87,152.25 139.87,157.25 98.77,157.25 69.83,128.32 45.77,128.32 42.27,124.82 v42.27,117.92 42.27,115.52 45.09,112.7 47.55,112.7 DRIVER.1.5 | 24V4.2 34.23,17.53 R1.1 | R4.1 178.87,38.23 178.97,38.32 | 177.91,138.82 R26.1 177.45,138.87 12V2.2
  Bottom 1.016: GND1.5 GND1.4 GND1.3 GND1.2 GND1.1 74.36,113.84 B1.GND@4 | R24.1 20.71,141.92 17.72,141.92 24V5.2
  Bottom 1.27: U$1.GND 24.79,55 22.59,55 21.16,56.43 21.16,58.72 19.89,60 13.39,60 9.86,63.52 9.86,79.52 15.27,84.92 15.27,89.32 17.86,91.92 21.16,91.92 21.16,101.82 24.73,105.39 35.28,105.39 ENCODER.A.1 35.17,105.29 v35.17,117.82 35.17,128.82 36.17,129.82 37.72,131.37 37.81,131.37 | GND.2 GND.1 | GND.2 GND.3 GND.4 GND.5 135.77,116.04 135.77,108.78 U$2.1 | 145.06,116.04 GND.2 | 37.81,131.37 41.97,135.52 61.43,135.52 90.27,164.36 142.53,164.36 151.66,155.22 151.66,152.52 153.97,150.22 176.87,150.22 177.45,149.63 | 37.81,131.37 36.56,130.12 | 124.43,219.89 ULN.1.8 | ULN.1.8 124.66,218.73 124.37,219.03 124.37,220.42 | 24V6.2 53.28,197.81 52.03,199.06 R28.1 36.47,200.32 30.17,206.62 30.17,225.62 56.67,225.62 56.23,225.18 | R27.1 155.12,193.19 12V3.2 | 56.23,222.92 ULN.2.8 56.23,225.18 | T1.3 149.31,231.06 147.87,229.62 137.87,229.62 137.77,229.52 | 137.77,229.52 136.06,227.82 129.77,227.82 128.47,226.52 128.47,223.82 126.81,222.17 124.56,222.17 | 56.23,225.18 91.31,225.18 94.31,222.17 124.56,222.17 | ULN.1.8 124.43,222.03 124.56,222.17 | T2.3 138.47,219.66 138.47,229.52 137.77,229.52
  Bottom 2.54: 12V1.2 163.16,11.72 163.16,11.42 | 163.16,10.62 163.16,11.42 | 163.16,11.42 163.62,11.87 | 24V2.2 142.14,5.39 142.06,5.32 141.77,5.02 | 12V3.2 154.95,198.22 147.16,198.22 137.16,188.22 52.36,188.22 52.36,192.53 52.85,193.02 24V6.2 | 24V3.2 48.78,150.92 45.36,150.92
  Bottom 4: 24V4.2 39.47,11.32 45.47,5.32 142.06,5.32 | 141.77,5.02 156.77,5.02 163.62,11.87 178.97,27.22 178.97,38.32 178.97,57.72 182.37,61.12 182.37,102.82 175.16,110.02 175.16,123.7 24V1.2 175.09,123.97 182.02,123.97 182.02,142.56 178.35,146.22 12V2.2 | 24V5.2 15.32,142.38 23.86,150.92 45.36,150.92 52.92,158.47 64.12,158.47 81.87,176.22 150.87,176.22 177.45,149.63 12V2.2 | 12V2.2 177.06,146.61
INT1.A
  Bottom 1: ENCODER.A.3 56.28,100.21 60.37,96.12 60.37,85.62 69.33,85.62 70.31,84.63 B1.3
INT1.B
  Bottom 1: U$1.D3 36.97,65.06 36.97,91.52 35.86,92.62 33.31,92.62 30.54,95.4 ENCODER.B.3
INT1.C
  Bottom 1: B1.20 71.84,56.69 66.27,51.12 66.27,32.62 74.06,24.82 94.37,24.82 96.97,22.22 123.87,22.22 149.37,47.72 149.37,70.52 152.06,73.22 159.37,73.22 160.5,74.36 ENCODER.C.4
INT1.D
  Bottom 1: B1.19 70.88,59.23 63.97,52.32 63.97,31.42 72.77,22.62 93.47,22.62 95.97,20.12 124.66,20.12 151.66,47.12 151.66,63.03 ENCODER.D.3
INT2.A
  Bottom 1: B1.2 69.22,82.09 68.02,83.29 57.97,83.29 57.97,94.62 54.92,97.67 ENCODER.A.4
INT2.B
  Bottom 1: ENCODER.B.4 29.54,92.86 32.17,90.22 34.17,90.22 34.77,89.62 34.77,62.52 U$1.D2
INT2.C
  Bottom 1: B1.21 73.7,54.15 68.77,49.22 68.77,33.42 75.17,27.02 95.06,27.02 97.77,24.32 122.97,24.32 146.97,48.32 146.97,72.72 149.77,75.52 158.16,75.52 159.55,76.9 ENCODER.C.3
INT2.D
  Bottom 1: B1.18 70.22,61.77 61.87,53.42 61.87,29.72 71.06,20.52 92.56,20.52 95.47,17.62 125.27,17.62 154.27,46.62 154.27,60.49 ENCODER.D.4
L1
  Bottom 1.016: LED12V17.A 18.89,123.84 15.32,127.42 24V5.1
  Bottom 4: F1.1 29.33,143.59 17.57,131.82 17.57,131.77 24V5.1
L2
  Bottom 1: LED12V19.A 168.16,134.43
  Bottom 4: 24V1.1 174.43,134.43 168.16,134.43 F7.1
N$7
  Bottom 4: U$3.P$1 49.47,27.22 24V4.1
N$8
  Bottom 4: U$3.P$2 34.39,34.85 28.07,28.52 28.07,24.22 28.48,23.81 F6.1
N$9
  Bottom 1: JP5.1 64.56,101.22 76.14,101.22 B1.9
N$10
  Bottom 1: JP5.2 75.9,98.28 B1.8
N$11
  Bottom 1: JP5.3 75.27,95.74 B1.7
N$12
  Bottom 1: JP5.4 72.59,93.2 73.53,92.25 B1.6
N$13
  Bottom 1: JP5.5 71.73,90.66 72.67,89.72 76.01,89.72 76.02,89.71 B1.5
N$14
  Bottom 1: JP5.6 71.37,88.12 72.31,87.17 B1.4
N$15
  Bottom 1.27: ULN.2.7 53.69,218.1 54.06,217.72 84.47,217.72 92.28,209.9 JP8.1
N$16
  Bottom 1.27: LED12V1.K 38.77,242.32 42.2,238.88 R8.2
N$17
  Bottom 1: B1.1 76.16,79.61 70.77,79.61 JP13.1
N$18
  Bottom 1: B1.0 70.72,77.01 JP13.2
N$21
  Bottom 1: LED12V18.K 56,69.62 51.11,64.73 R25.2
N$22
  Bottom 1: R26.2 171.06,140.19 LED12V19.K
N$23
  Bottom 1.016: R1.2 23.99,19.78 21.93,21.84 LED24V.K
N$24
  Bottom 1: LED12V.K 171.61,48.46 R4.2
N$25
  Bottom 4: F6.2 28.48,43.43 26.76,41.72 17.36,41.72 16.57,42.52 16.57,44.98 | 16.57,45.62 16.57,44.98 | 16.57,44.98 D1.A
N$27
  Bottom 1.27: LED12V2.K 48.86,242.82 51.47,240.22 54.77,240.22 54.77,240.68 R9.2
N$29
  Bottom 1.27: LED12V3.K 59.87,243.22 63.61,239.48 R10.2
N$30
  Bottom 1.27: LED12V4.K 70.97,243.02 74.67,239.32 76.53,239.32 R11.2
N$31
  Bottom 1.27: R12.2 87.97,240.72 LED12V5.K
N$32
  Bottom 1.27: LED12V6.K 6.16,240.32 6.9,239.58 R13.2
N$33
  Bottom 1.27: LED12V7.K 16.46,242.92 20.2,239.18 R14.2
N$34
  Bottom 1.27: LED12V8.K 27.67,242.82 31.21,239.28 R15.2
N$35
  Bottom 1.27: LED12V9.K 93.56,242.22 96.61,239.18 R16.2
N$36
  Bottom 1.27: LED12V10.K 104.67,243.72 108.87,239.52 108.92,239.58 R17.2
N$37
  Bottom 1: B1.42 104.16,121.42 121.68,138.94 JP7.2
N$38
  Bottom 1: B1.44 106.7,119.52 124.22,137.04 JP7.3
N$39
  Bottom 1: B1.46 109.23,117.72 126.75,135.24 JP7.4
N$40
  Bottom 1: B1.48 111.7,46.61 111.7,116.02 129.3,133.62 JP7.5
N$41
  Bottom 1: B1.50 114.31,115.52 131.84,133.04 JP7.6
N$42
  Bottom 1: B1.52 116.86,114.62 134.38,132.14 JP7.7
N$44
  Bottom 1.27: LED12V11.K 117.77,245.32 120.06,243.02 R18.2
N$46
  Bottom 1.27: R19.2 130.16,242.02 LED12V12.K
N$47
  Bottom 1: JP2.1 129.9,49.07 B1.A15
N$48
  Bottom 1: B1.A14 128.25,51.61 133.12,56.48 JP2.2
N$49
  Bottom 1: B1.A13 127.9,54.15 132.87,59.12 134.66,59.12 JP2.3
N$50
  Bottom 1: B1.A0 129.56,89.71 132.13,87.15 JP3.9
N$51
  Bottom 1: B1.A1 129.08,87.17 131.47,84.77 134.77,84.77 JP3.8
N$52
  Bottom 1: JP3.7 130.74,82.07 128.18,84.63 B1.A2
N$53
  Bottom 1: B1.A3 127.4,82.09 129.87,79.62 134.67,79.62 JP3.6
N$54
  Bottom 1: B1.A4 126.84,79.55 129.4,76.99 JP3.5
N$55
  Bottom 1: B1.A5 126.47,77.01 129.04,74.45 JP3.4
N$56
  Bottom 1: B1.A6 125.97,74.47 128.54,71.91 JP3.3
N$57
  Bottom 1: JP3.2 134.73,69.33 127.08,69.33 B1.A7
N$58
  Bottom 1: JP3.1 124.56,66.83 124.51,66.88 B1.A8
N$59
  Bottom 1: B1.A12 127.24,56.69 132.1,61.56 JP2.4
N$60
  Bottom 1: B1.A11 126.18,59.23 131.05,64.1 JP2.5
N$61
  Bottom 1.27: LED12V13.K 137.97,243.32 141.31,239.98 R20.2
N$62
  Bottom 1.27: R21.2 151.71,242.08 147.87,245.92 LED12V14.K
N$63
  Bottom 1.27: LED12V15.K 165.83,248.58 R22.2
N$64
  Bottom 1.27: R23.2 164.83,232.42 LED12V16.K
N$65
  Bottom 1.016: R24.2 21.16,123.29 LED12V17.K
N$66
  Bottom 1.27: ULN.2.6 51.14,216.74 52.56,215.32 82.77,215.32 89.75,208.34 JP8.2
N$67
  Bottom 1.27: ULN.2.5 48.61,214.18 49.77,213.02 81.47,213.02 87.2,207.28 JP8.3
N$68
  Bottom 1.27: ULN.2.4 46.06,211.72 47.27,210.52 79.97,210.52 84.67,205.82 JP8.4
N$69
  Bottom 1.27: ULN.2.3 43.53,209.56 44.97,208.12 78.27,208.12 82.12,204.26 JP8.5
N$70
  Bottom 1.27: ULN.2.2 40.98,207.4 42.67,205.72 77.37,205.72 79.59,203.5 JP8.6
N$71
  Bottom 1.27: ULN.2.1 38.44,204.74 39.86,203.32 71.37,203.32 73.87,200.82 76.84,200.82 JP8.7
N$72
  Bottom 1.27: ULN.1.7 121.88,211.04 114.37,203.52 110.56,203.52 110.28,203.24 JP10.1
N$73
  Bottom 1.27: JP10.2 107.75,205.7 107.97,205.92 111.77,205.92 119.34,213.5 ULN.1.6
N$74
  Bottom 1.27: JP10.3 105.2,208.22 110.77,208.22 116.81,214.26 ULN.1.5
N$75
  Bottom 1: B1.41 101.56,43.93 101.56,40.02 101.86,39.72 JP6.7
N$76
  Bottom 1: B1.45 106.7,36.27 JP6.5
N$77
  Bottom 1: B1.43 104.16,35.92 104.4,35.92 JP6.6
N$78
  Bottom 1: B1.47 109.23,36.27 JP6.4
N$79
  Bottom 1: B1.49 111.77,36.52 JP6.3 112.06,36.27 112.06,35.52
N$80
  Bottom 1: B1.51 114.31,36.27 JP6.2
N$81
  Bottom 1: B1.53 116.86,35.72 117.09,35.72 | 117.56,35.72 117.09,35.72 | 117.09,35.72 JP6.1
N$82
  Bottom 1.27: ULN.1.4 114.27,215.02 109.77,210.52 104.06,210.52 102.67,209.12 JP10.4
N$88
  Bottom 1.27: JP10.5 100.12,210.98 102.17,213.02 108.87,213.02 111.73,215.88 ULN.1.3
N$89
  Bottom 1.27: ULN.1.2 109.19,216.74 107.77,215.32 100.47,215.32 97.59,212.44 JP10.6
N$90
  Bottom 1.27: JP10.7 95.05,213.9 99.77,218.62 106.52,218.62 ULN.1.1
N$91
  Bottom 1: B1.35 94,34.42 JP11.1
N$92
  Bottom 1: JP11.2 91.45,34.53 B1.33
N$93
  Bottom 1: B1.31 88.92,34.42 JP11.3
N$94
  Bottom 1: B1.29 86.38,34.42 JP11.4
N$95
  Bottom 1: B1.27 83.84,34.42 JP11.5
N$96
  Bottom 1: 81.3,43.79 81.3,34.12 81.19,34.12 JP11.6
  Bottom 1.016: B1.25 81.3,43.79
N$97
  Bottom 1: B1.23 78.76,34.42 JP11.7
N$98
  Bottom 1: B1.26 83.84,130.02 101.15,147.33 JP12.1
N$99
  Bottom 1: B1.28 86.38,129.42 86.87,129.42 103.69,146.24 JP12.2
N$100
  Bottom 1: B1.30 88.92,128.52 89.27,128.52 106.47,145.72 106.47,149.58 JP12.3
N$101
  Bottom 1: B1.32 91.47,127.12 108.77,144.42 JP12.4
N$102
  Bottom 1.27: T1.1 145.71,225.98 R6.2
N$103
  Bottom 1.27: T2.1 148.85,213.62 R7.2
N$104
  Bottom 1: B1.34 94,125.62 111.31,142.93 JP12.5
N$106
  Bottom 1: JP12.6 113.84,149.32 113.75,149.22 113.75,141.82 96.53,124.61 B1.36
N$107
  Bottom 1: JP17.1 U$1.D13
N$108
  Bottom 1: B1.38 99.08,123.72 116.39,141.03 JP12.7
N$109
  Bottom 1: B1.A9 122.68,64.31 121.63,65.35 121.63,113.42 139.63,131.42 JP14.2
N$110
  Bottom 1: JP4.8 24.79,80.4 U$1.A0
N$111
  Bottom 1: JP4.7 24.79,77.86 U$1.A1
N$112
  Bottom 1: JP4.6 24.79,75.32 U$1.A2
N$113
  Bottom 1: JP4.5 24.79,72.78 U$1.A3
N$114
  Bottom 1: JP4.4 19.44,70.14 U$1.A4
N$115
  Bottom 1: JP4.3 24.79,67.7 U$1.A5
N$116
  Bottom 1: JP4.2 24.79,65.16 U$1.A6
N$117
  Bottom 1: JP4.1 24.79,62.62 U$1.A7
N$118
  Bottom 1: B1.A10 119.27,61.77 119.27,113.92 137.09,131.75 JP14.1
N$120
  Bottom 1.27: R6.1 133.19,218.44 JP15.1
N$121
  Bottom 1.27: R7.1 133.19,208.64 121.47,196.92 113.17,196.92 112.87,197.22 JP16.1
N$122
  Bottom 1: U$1.D12 40.2,88 40.28,88.01 JP1.1
N$123
  Bottom 1: U$1.D11 40.23,85.48 JP1.2
N$124
  Bottom 1: U$1.D10 47.08,82.84 JP1.3
N$125
  Bottom 1: U$1.D9 40.22,80.39 JP1.4
N$126
  Bottom 1: U$1.D8 40.23,77.66 41.15,77.85 JP1.5
N$127
  Bottom 1: U$1.D7 47.08,75.22 JP1.6
N$128
  Bottom 1: U$1.D6 47.08,72.68 JP1.7
N$131
  Bottom 1.27: R27.2 160.21,197.32 161.31,196.22 LED12V20.K
N$132
  Bottom 1.27: LED12V21.K 57.23,200.19 R28.2
N$135
  Bottom 1: U$1.RX1 46.27,54.9 JP9.1
N$136
  Bottom 1: U$1.TX0 40.43,52.06 46.72,52.06 46.74,52.05 JP9.2
N$152
  Bottom 2.54: F3.1 154.38,24.56 154.38,15.5 12V1.1
PWM.A
  Bottom 1: B1.13 76.14,111.22 62.67,111.22 53.77,120.12 DRIVER.1.2
PWM.B
  Bottom 1: B1.12 61.49,108.76 55.22,115.04 DRIVER.1.4
PWM.C
  Bottom 1: DRIVER.2.2 144.56,87.76 144.56,94.32 149.37,99.12 154.87,99.12 156.62,100.87 156.62,114.72 150.16,114.72 146.97,117.92 146.97,153.22 140.77,159.42 94.77,159.42 66.06,130.72 44.06,130.72 39.67,126.32 39.67,114.72 44.56,109.82 56.17,109.82 59.77,106.22 B1.11
PWM.D
  Bottom 1: DRIVER.2.4 157.48,92.84 158.87,94.22 158.87,117.62 151.66,117.62 149.06,120.22 149.06,154.32 141.77,161.62 92.27,161.62 63.67,133.02 43.27,133.02 37.56,127.32 37.56,112.82 42.86,107.52 55.06,107.52 58.91,103.68 B1.10
RESET.MEGA
  Bottom 1.27: 131.16,111.39 U$2.2 130.08,107.49 B1.RESET | 131.16,111.39 R5.1 | 131.16,111.39
RX.BLUE
  Bottom 1: BLUETOOTH.2 59.78,61.64 60.53,62.39 60.53,64.42 | 60.53,64.42 R3.2 63.18,66.3 R2.1 | 60.53,64.42 60.6,64.42
RX.NANO
  Bottom 1: B1.14 68.47,71.92 63.56,76.82 50.36,76.82 50.36,71.22 49.28,70.14 U$1.D5
STATE
  Bottom 1: BLUETOOTH.1 58.53,67.54 LED12V18.A
TX.BLUE
  Bottom 1: B1.17 65.42,64.31 62.84,61.74 62.84,59.1 BLUETOOTH.3
TX.MEGA
  Bottom 1: B1.16 71.35,66.85 R2.2
TX.NANO
  Bottom 1: U$1.D4 50.84,67.6 52.56,69.32 52.56,74.12 63.37,74.12 68.06,69.42 76.19,69.42 B1.15